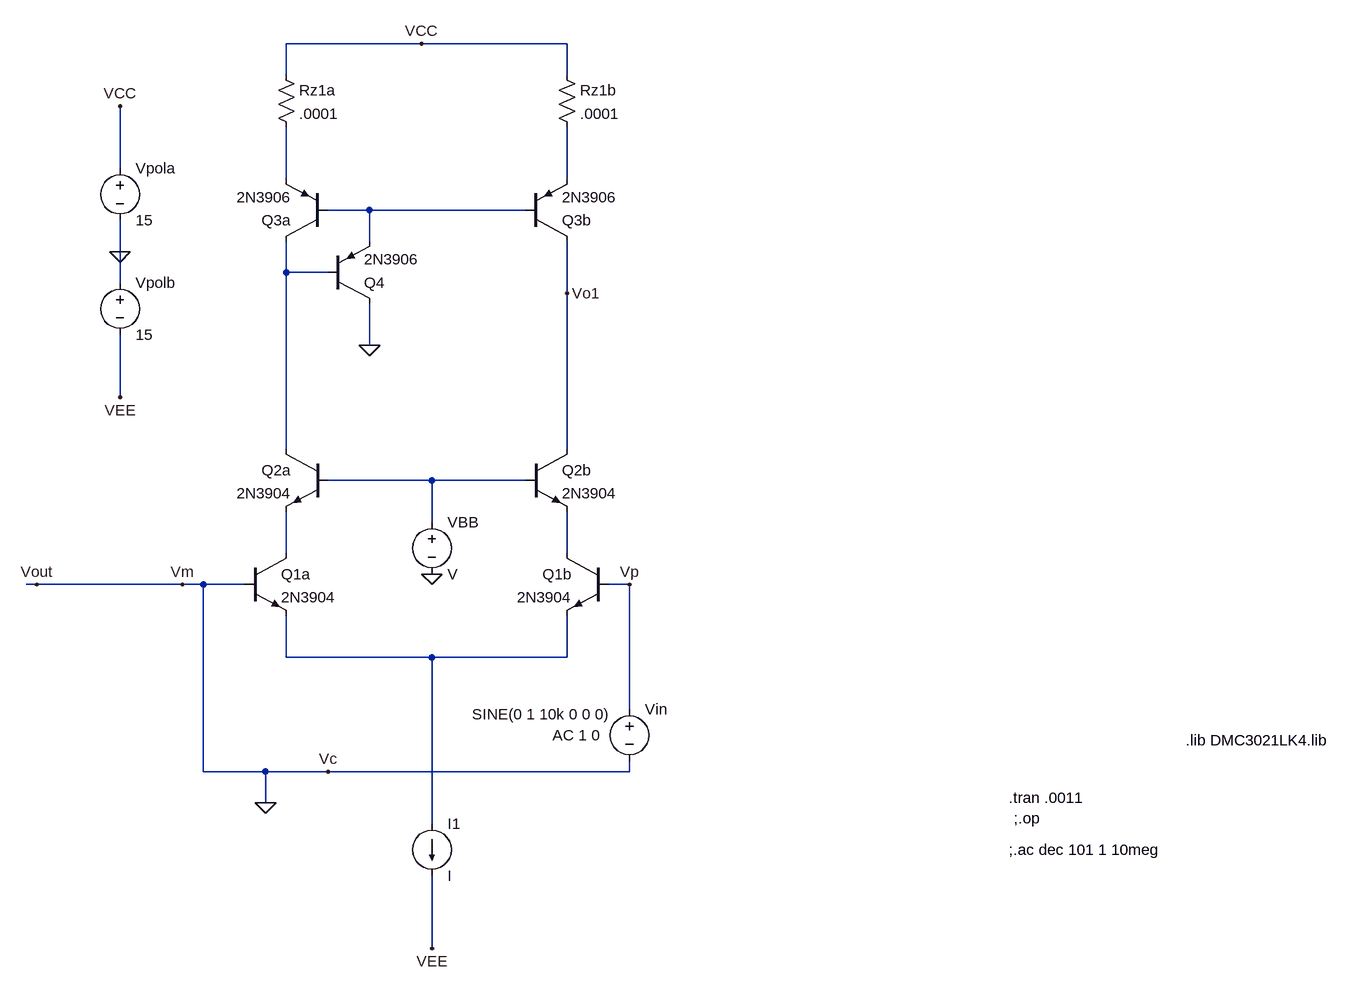
[diagram p0: schematic Etage_1_simple.asc]
Etage_1_simple.asc, the LTspice schematic file:
Version 4
SHEET 1 2404 1432
WIRE 288 -464 80 -464
WIRE 512 -464 288 -464
WIRE 80 -416 80 -464
WIRE 512 -416 512 -464
WIRE -176 -272 -176 -368
WIRE 80 -256 80 -336
WIRE 512 -256 512 -336
WIRE 208 -208 144 -208
WIRE 448 -208 208 -208
WIRE 208 -160 208 -208
WIRE -176 -144 -176 -192
WIRE 80 -112 80 -160
WIRE 144 -112 80 -112
WIRE -176 -96 -176 -144
WIRE 512 -80 512 -160
WIRE 208 0 208 -64
WIRE -176 80 -176 -16
WIRE 80 160 80 -112
WIRE 512 160 512 -80
WIRE 304 208 144 208
WIRE 448 208 304 208
WIRE 304 272 304 208
WIRE 80 320 80 256
WIRE 512 320 512 256
WIRE -304 368 -320 368
WIRE -80 368 -304 368
WIRE -48 368 -80 368
WIRE 16 368 -48 368
WIRE 608 368 576 368
WIRE 80 480 80 416
WIRE 304 480 80 480
WIRE 512 480 512 416
WIRE 512 480 304 480
WIRE 608 560 608 368
WIRE -48 656 -48 368
WIRE 48 656 -48 656
WIRE 144 656 48 656
WIRE 608 656 608 640
WIRE 608 656 144 656
WIRE 48 704 48 656
WIRE 304 736 304 480
WIRE 304 928 304 816
FLAG 288 -464 VCC
FLAG -176 -368 VCC
FLAG -176 80 VEE
FLAG -176 -144 0
FLAG 512 -80 Vo1
FLAG 608 368 Vp
FLAG -80 368 Vm
FLAG 208 0 0
FLAG 144 656 Vc
FLAG -304 368 Vout
FLAG 48 704 0
FLAG 304 352 0
FLAG 304 928 VEE
SYMBOL npn 16 320 R0
SYMATTR InstName Q1a
SYMATTR Value 2N3904
SYMBOL npn 576 320 M0
SYMATTR InstName Q1b
SYMATTR Value 2N3904
SYMBOL npn 448 160 R0
SYMATTR InstName Q2b
SYMATTR Value 2N3904
SYMBOL npn 144 160 M0
SYMATTR InstName Q2a
SYMATTR Value 2N3904
SYMBOL pnp 144 -160 R180
SYMATTR InstName Q3a
SYMATTR Value 2N3906
SYMBOL pnp 144 -64 M180
SYMATTR InstName Q4
SYMATTR Value 2N3906
SYMBOL pnp 448 -160 M180
SYMATTR InstName Q3b
SYMATTR Value 2N3906
SYMBOL res 64 -432 R0
SYMATTR InstName Rz1a
SYMATTR Value .0001
SYMBOL res 496 -432 R0
SYMATTR InstName Rz1b
SYMATTR Value .0001
SYMBOL voltage 608 544 R0
WINDOW 123 -118 56 Left 2
WINDOW 39 0 0 Left 0
WINDOW 3 -242 24 Left 2
SYMATTR Value2 AC 1 0
SYMATTR Value SINE(0 1 10k 0 0 0)
SYMATTR InstName Vin
SYMBOL voltage -176 -288 R0
WINDOW 123 0 0 Left 0
WINDOW 39 0 0 Left 0
SYMATTR InstName Vpola
SYMATTR Value 15
SYMBOL voltage -176 -112 R0
WINDOW 123 0 0 Left 0
WINDOW 39 0 0 Left 0
SYMATTR InstName Vpolb
SYMATTR Value 15
SYMBOL current 304 736 R0
SYMATTR InstName I1
SYMBOL voltage 304 256 R0
SYMATTR InstName VBB
TEXT 1200 728 Left 2 !;.op
TEXT 1192 776 Left 2 !;.ac dec 101 1 10meg
TEXT 1192 696 Left 2 !.tran .0011
TEXT 1464 608 Left 2 !.lib DMC3021LK4.lib

The netlist it stands for:
* Etage_1_simple.asc
Q1a N006 0 N008 0 2N3904
Q1b N007 Vp N008 0 2N3904
Q2b Vo1 N005 N007 0 2N3904
Q2a N004 N005 N006 0 2N3904
Q3a N004 N003 N001 0 2N3906
Q4 0 N004 N003 0 2N3906
Q3b Vo1 N003 N002 0 2N3906
Rz1a VCC N001 .0001
Rz1b VCC N002 .0001
Vin Vp 0 SINE(0 1 10k 0 0 0) AC 1 0
Vpola VCC 0 15
Vpolb 0 VEE 15
I1 N008 VEE I
VBB N005 0 V
.model NPN NPN
.model PNP PNP
.lib standard.bjt
;.op
;.ac dec 101 1 10meg
.tran .0011
.lib DMC3021LK4.lib
.backanno
.end